# EAGLE design portable-atmega (EAGLE 7.2.0)
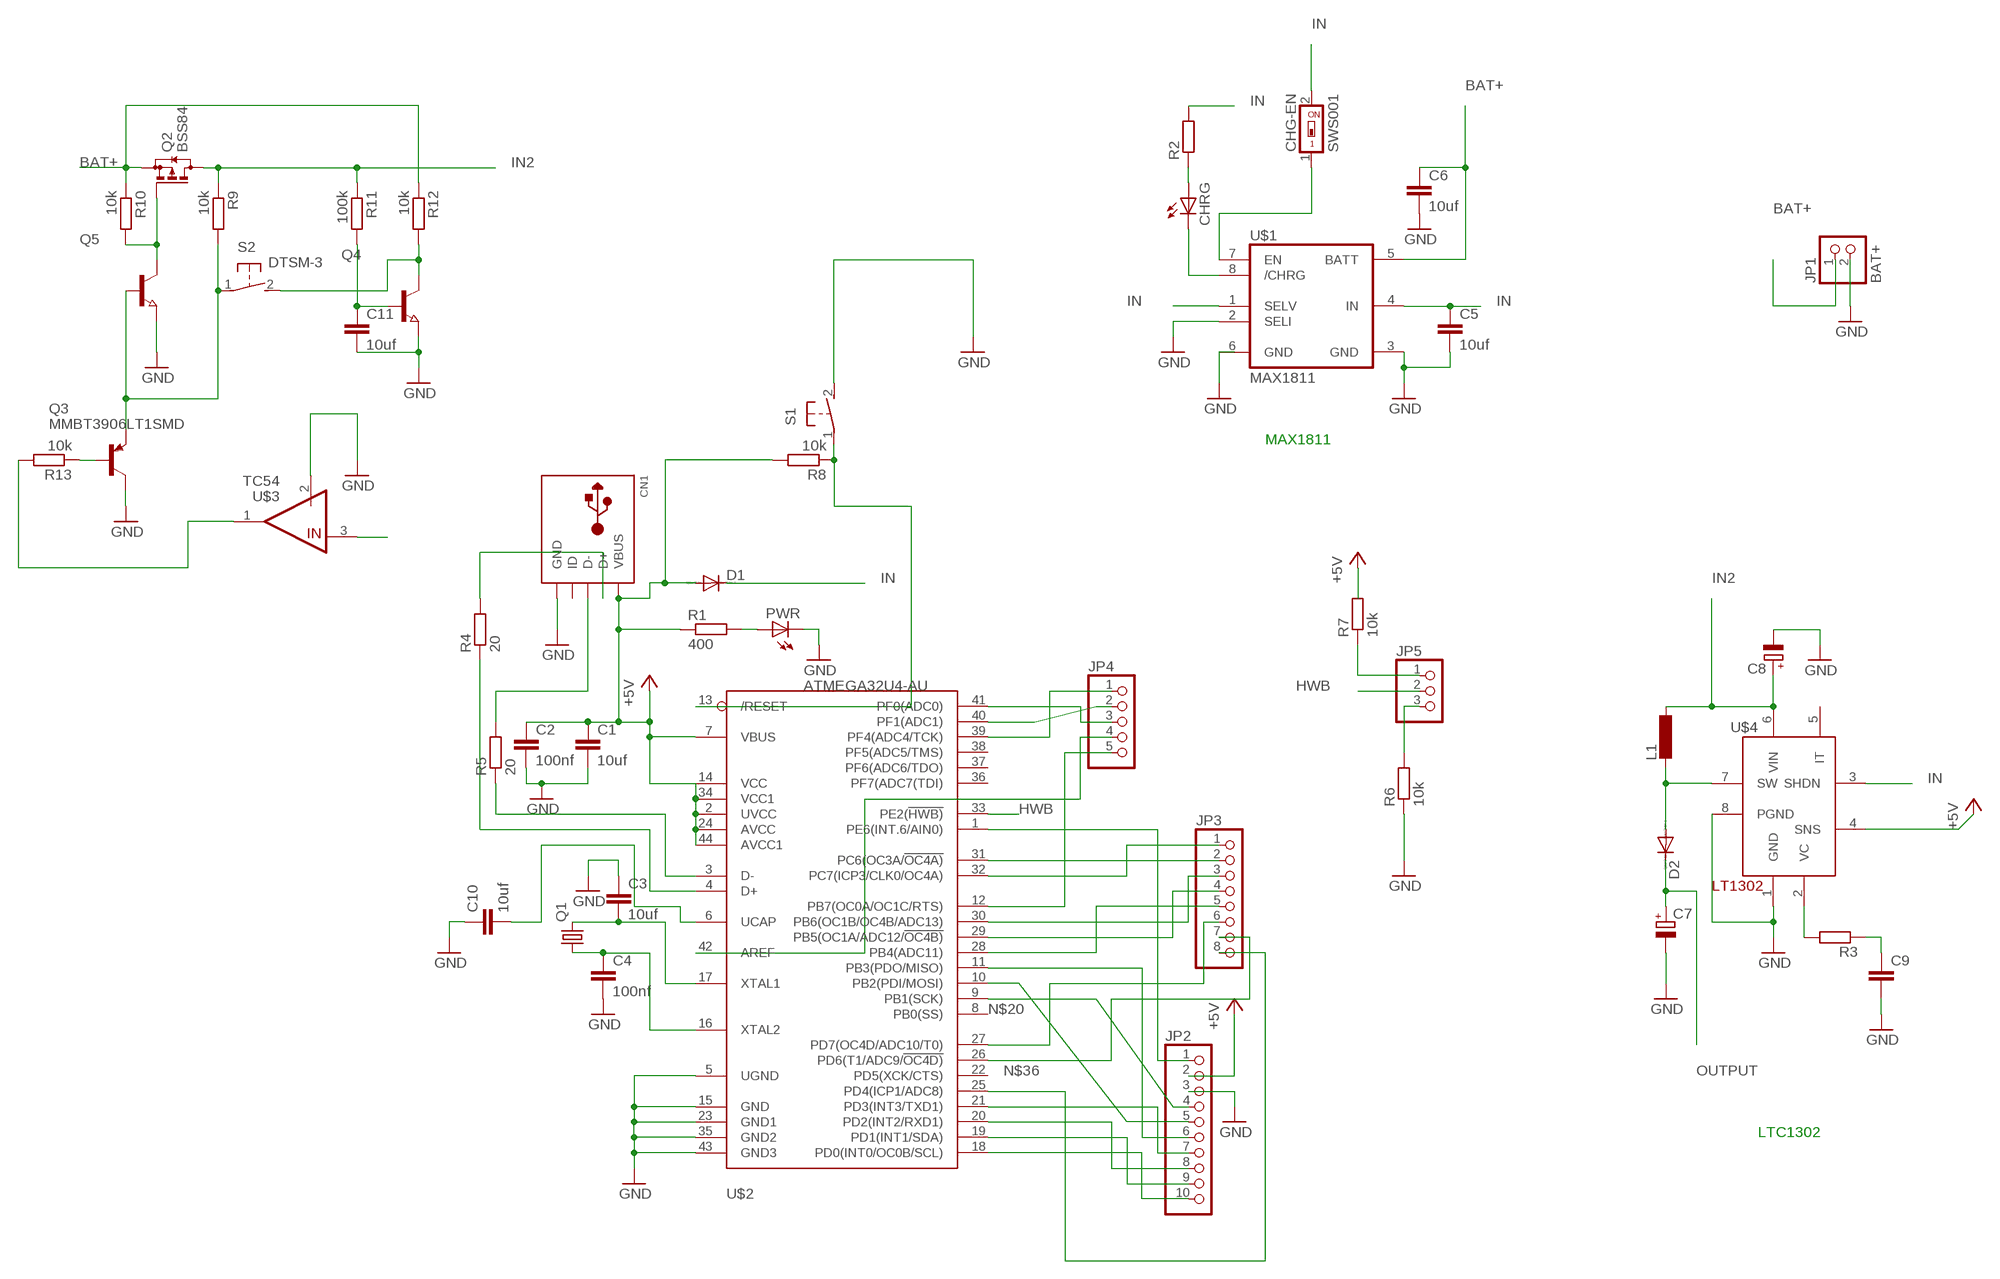
[diagram p0: schematic, sheet 1]

## Parts
C1  10uf  C-EUC1206  [C1206]
C2  100nf  C-EUC1206  [C1206]
C3  10uf  C-EUC1206  [C1206]
C4  100nf  C-EUC1206  [C1206]
C5  10uf  C-EUC1206  [C1206]
C6  10uf  C-EUC1206  [C1206]
C7  CPOL-EUD  [PANASONIC_D]
C8  CPOL-EUD  [PANASONIC_D]
C9  C-EUC1206  [C1206]
C10  10uf  C-EUC1206  [C1206]
C11  10uf  C-EUC1206  [C1206]
CHG-EN  SWS001  [SMS-001]
CHRG  LEDCHIPLED_1206  [CHIPLED_1206]
CN1  USBMINIB  [USB-MINIB]
D1  DIODE-DO214AA  [DO214AA]
D2  DIODE-DO214AA  [DO214AA]
JP1  BAT+  PINHD-1X2  [1X02]
JP2  PINHD-1X10  [1X10]
JP3  PINHD-1X8  [1X08]
JP4  PINHD-1X5  [1X05]
JP5  PINHD-1X3  [1X03]
L1  DO3316P  [DO3316P]
PWR  LEDCHIPLED_1206  [CHIPLED_1206]
Q1  CRYSTALHC49S  [HC49/S]
Q2  BSS84  [SOT23]
Q3  MMBT3906LT1SMD  [SOT23-BEC]
Q4  NPN-TRANSISTOR_SOT23  [SOT23]
Q5  NPN-TRANSISTOR_SOT23  [SOT23]
R1  400  R-EU_R1206  [R1206]
R2  R-EU_R1206  [R1206]
R3  R-EU_R1206  [R1206]
R4  20  R-EU_R1206  [R1206]
R5  20  R-EU_R1206  [R1206]
R6  10k  R-EU_R0805  [R0805]
R7  10k  R-EU_R0805  [R0805]
R8  10k  R-EU_R0805  [R0805]
R9  10k  R-EU_R0805  [R0805]
R10  10k  R-EU_R1206  [R1206]
R11  100k  R-EU_R0805  [R0805]
R12  10k  R-EU_R1206  [R1206]
R13  10k  R-EU_R0805  [R0805]
S1  31-XXSKINNY  [B3F-31XX-SKINNIER]
S2  DTSM-3  [DTSM-3]
U$1  MAX1811  [SO08]
U$2  ATMEGA32U4-AU  [TQFP44]
U$3  TC54  [SOT23-3]
U$4  LT1302SO8  [SO08]

## Nets
+5V: C1.1 C2.1 CN1.VBUS D1.A JP2.2 R1.1 R7.2 R8.2 U$2.2(UVCC) U$2.7(VBUS) U$2.14(VCC) U$2.24(AVCC) U$2.34(VCC1) U$2.44(AVCC1) U$4.4(SNS)
BAT+: C6.1 JP1.1 Q2.2(S) R10.1 R12.1 U$1.5(BATT) U$3.3(VIN)
GND: C1.2 C2.2 C3.1 C4.2 C5.2 C6.2 C7.- C8.- C9.2 C10.1 C11.2 CN1.GND JP1.2 JP2.3 PWR.C Q3.C Q4.2(E) Q5.2(E) R6.1 S1.2(S) U$1.2(SELI) U$1.3(GND) U$1.6(GND) U$2.5(UGND) U$2.15(GND) U$2.23(GND1) U$2.35(GND2) U$2.43(GND3) U$3.2(VSS) U$4.1(GND) U$4.8(PGND)
HWB: JP5.2 U$2.33(PE2(!HWB))
IN: C5.1 CHG-EN.2 D1.C R2.2 U$1.1(SELV) U$1.4(IN) U$4.3(SHDN)
IN2: C8.+ L1.2 Q2.3(D) R9.1 R11.1 U$4.6(VIN)
N$1: PWR.A R1.2
N$2: CN1.D- R5.2
N$3: C4.1 Q1.1 U$2.16(XTAL2)
N$4: CHRG.C U$1.8(/CHRG)
N$5: CHRG.A R2.1
N$6: C3.2 Q1.2 U$2.17(XTAL1)
N$7: CHG-EN.1 U$1.7(EN)
N$8: D2.A L1.1 U$4.7(SW)
N$9: R4.1 U$2.4(D+)
N$10: CN1.D+ R4.2
N$11: R5.1 U$2.3(D-)
N$12: C9.1 R3.1
N$13: R3.2 U$4.2(VC)
N$14: C10.2 U$2.6(UCAP)
N$15: JP2.10 U$2.18(PD0(INT0/OC0B/SCL))
N$16: JP2.9 U$2.19(PD1(INT1/SDA))
N$17: JP2.8 U$2.20(PD2(INT2/RXD1))
N$18: JP2.7 U$2.21(PD3(INT3/TXD1))
N$19: JP2.1 U$2.1(PE6(INT.6/AIN0))
N$20: JP2.4 U$2.9(PB1(SCK))
N$21: JP2.5 U$2.10(PB2(PDI/MOSI))
N$22: JP2.6 U$2.11(PB3(PDO/MISO))
N$23: JP4.4 U$2.42(AREF)
N$24: JP4.3 U$2.41(PF0(ADC0))
N$25: JP4.2 U$2.40(PF1(ADC1))
N$26: JP4.1 U$2.39(PF4(ADC4/TCK))
N$27: JP5.3 R6.2
N$28: JP3.1 U$2.32(PC7(ICP3/CLK0/OC4A))
N$29: JP3.2 U$2.31(PC6(OC3A/!OC4A))
N$30: JP3.3 U$2.30(PB6(OC1B/OC4B/ADC13))
N$31: JP5.1 R7.1
N$32: R8.1 S1.1(P) U$2.13(/RESET)
N$33: JP3.4 U$2.29(PB5(OC1A/ADC12/!OC4B))
N$34: JP3.5 U$2.28(PB4(ADC11))
N$35: JP3.6 U$2.27(PD7(OC4D/ADC10/T0))
N$36: JP3.7 U$2.26(PD6(T1/ADC9/!OC4D))
N$37: JP3.8 U$2.25(PD4(ICP1/ADC8))
N$38: JP4.5 U$2.12(PB7(OC0A/OC1C/RTS))
N$39: Q2.1(G) Q5.3(C) R10.2
N$40: Q3.E Q5.1(B) R9.2 S2.1
N$42: C11.1 Q4.1(B) R11.2
N$43: Q4.3(C) R12.2 S2.2
N$46: R13.2 U$3.1(VOUT)
N$47: Q3.B R13.1
OUTPUT: C7.+ D2.C
Unconnected: CN1.ID U$2.8(PB0(SS)) U$2.22(PD5(XCK/CTS)) U$2.36(PF7(ADC7(TDI)) U$2.37(PF6(ADC6/TDO)) U$2.38(PF5(ADC5/TMS)) U$4.5(IT)

## Notes on the sheet
- MAX1811
- LTC1302

## Library data of the parts
C1-C6 C9-C11 = resistor:C-EU: CAPACITOR, European symbol
C7 C8 = resistor:CPOL-EU: POLARIZED CAPACITOR, European symbol
CHG-EN = smd-special:SWS001: SMD Dip Switch 1 pol.
CHRG PWR = adafruit:LED: LED OSRAM: - CHIPLED LG R971, LG N971, LY N971, LG Q971, LY Q971, LO R971, LY R971 LH N974, LH R974 LS Q976, LO Q976, LY Q976 LO Q996 - Hyper CHIPLED LW Q18S LB Q993, LB Q99A, LB R99A - SideLED LS A670, LO A670, LY A670, LG A670, LP A670 LB A673, LV A673, LT A673, LW A673 LH A674 LY A675 LS A676, LA A676, LO A676, LY A676, LW A676 LS A679, LY A679, LG A679 - Hyper Micro SIDELED® LS Y876, LA Y876, LO Y876, LY Y876 LT Y87S - SmartLED LW L88C, LW L88S LB L89C, LB L89S, LG L890 LS L89K, LO L89K, LY L89K LS L896, LA L896, LO L896, LY L896 - TOPLED LS T670, LO T670, LY T670, LG T670, LP T670 LSG T670, LSP T670, LSY T670, LOP T670, LYG T670 LG T671, LOG T671, LSG T671 LB T673, LV T673, LT T673, LW T673 LH T674 LS T676, LA T676, LO T676, LY T676, LB T676, LH T676, LSB T676, LW T676 LB T67C, LV T67C, LT T67C, LS T67K, LO T67K, LY T67K, LW E67C LS E67B, LA E67B, LO E67B, LY E67B, LB E67C, LV E67C, LT E67C LW T67C LS T679, LY T679, LG T679 LS T770, LO T770, LY T770, LG T770, LP T770 LB T773, LV T773, LT T773, LW T773 LH T774 LS E675, LA E675, LY E675, LS T675 LS T776, LA T776, LO T776, LY T776, LB T776 LHGB T686 LT T68C, LB T68C - Hyper Mini TOPLED® LB M676 - Mini TOPLED Santana® LG M470 LS M47K, LO M47K, LY M47K Source: http://www.osram.convergy.de/
CN1 = adafruit:USB: USB Connectors USBMINIB - Surface Mount Female Mini-B USB Connector 4UConnector: 06564 By microbuilder.eu Thru-hole RA Female Mini-B USB Connector 4UConnector: 18732 By ladyada.net
D1 D2 = diode:DIODE-: DIODE
JP1 = pinhead:PINHD-1X2: PIN HEADER
JP2 = pinhead:PINHD-1X10: PIN HEADER
JP3 = pinhead:PINHD-1X8: PIN HEADER
JP4 = pinhead:PINHD-1X5: PIN HEADER
JP5 = adafruit:PINHD-1X3: PIN HEADER
L1 = inductor-coilcraft:DO3316P: COILCRAFT; OC_FARNELL: unknown; OC_NEWARK: unknown
Q1 = adafruit:CRYSTAL: CRYSTAL; OC_FARNELL: 1667008; OC_NEWARK: unknown
Q2 = transistor-small-signal:BSS84: P-CHANNEL MOS FET
Q3 = transistor-pnp:MMBT3906*: PNP Transistror
Q4 Q5 = semicon-smd-ipc:NPN-TRANSISTOR_: NPN TRANSISTOR
R1-R5 R10 R12 = resistor:R-EU_: RESISTOR, European symbol
R6-R9 R11 R13 = solar3-1:R-EU_: RESISTOR, European symbol
S1 = adafruit:31-XX: OMRON SWITCH Now with beefier pads!
S2 = switch-tact:DTSM-3
U$1 = max1811-modified:MAX1811
U$2 = adafruit:ATMEGA32U4: http://www.ladyada.net/library/eagle
U$3 = microchip:TC54
U$4 = adafruit:LT1302

## Board
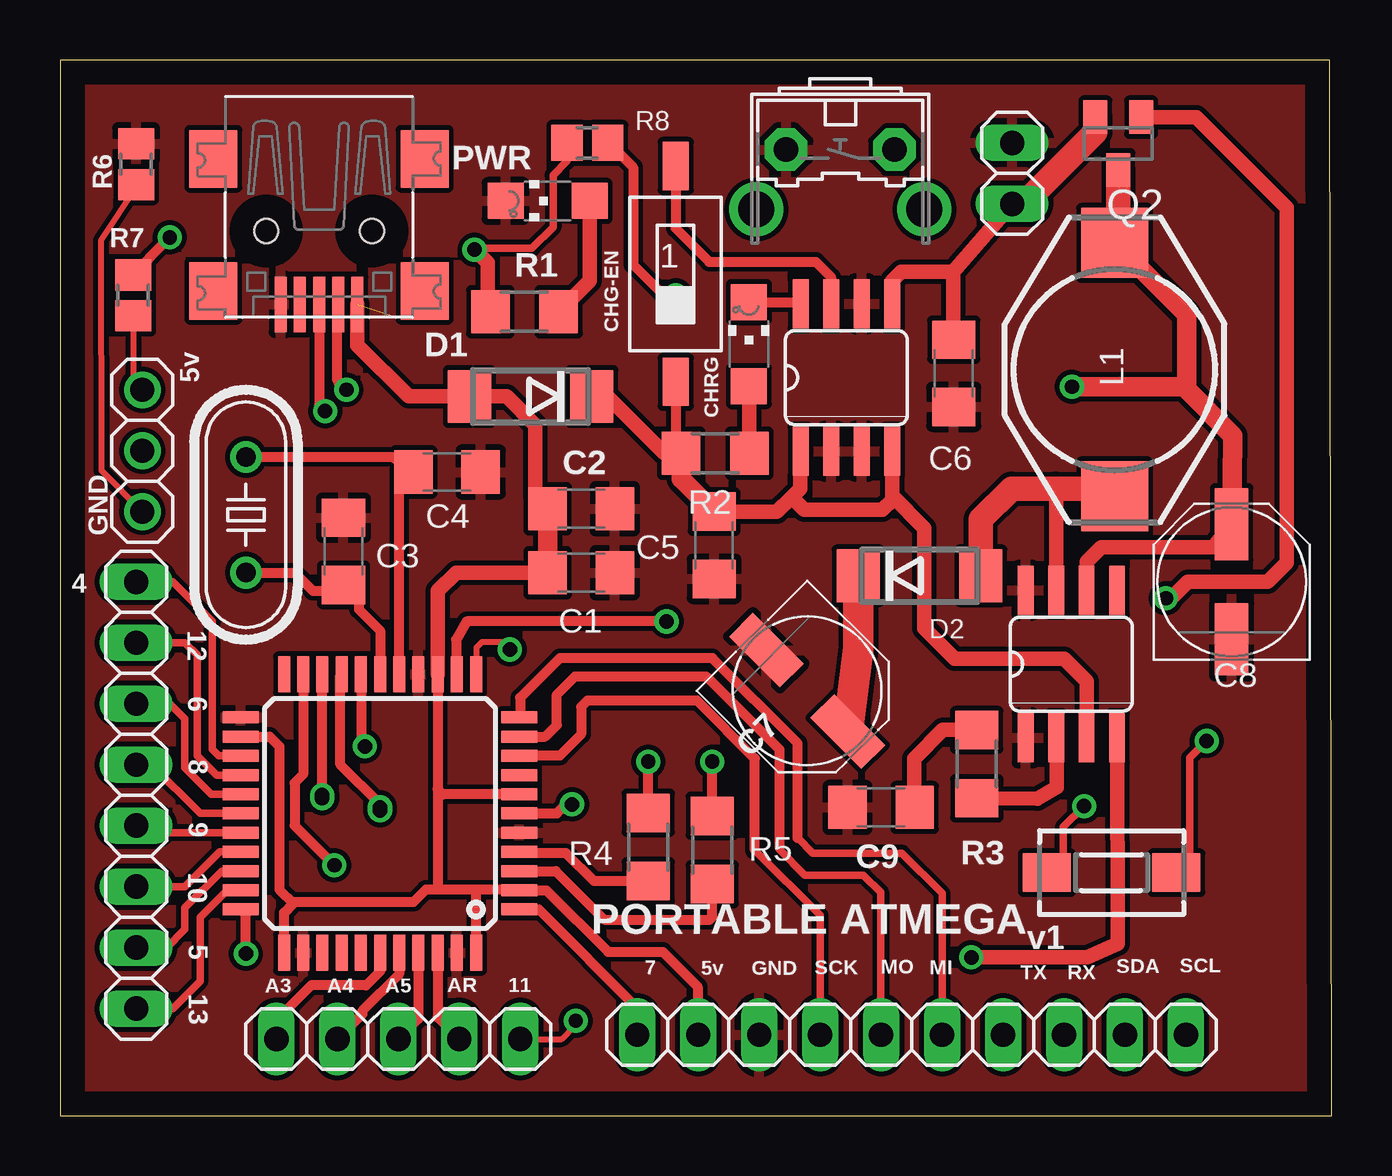
[diagram p1: board, top side]
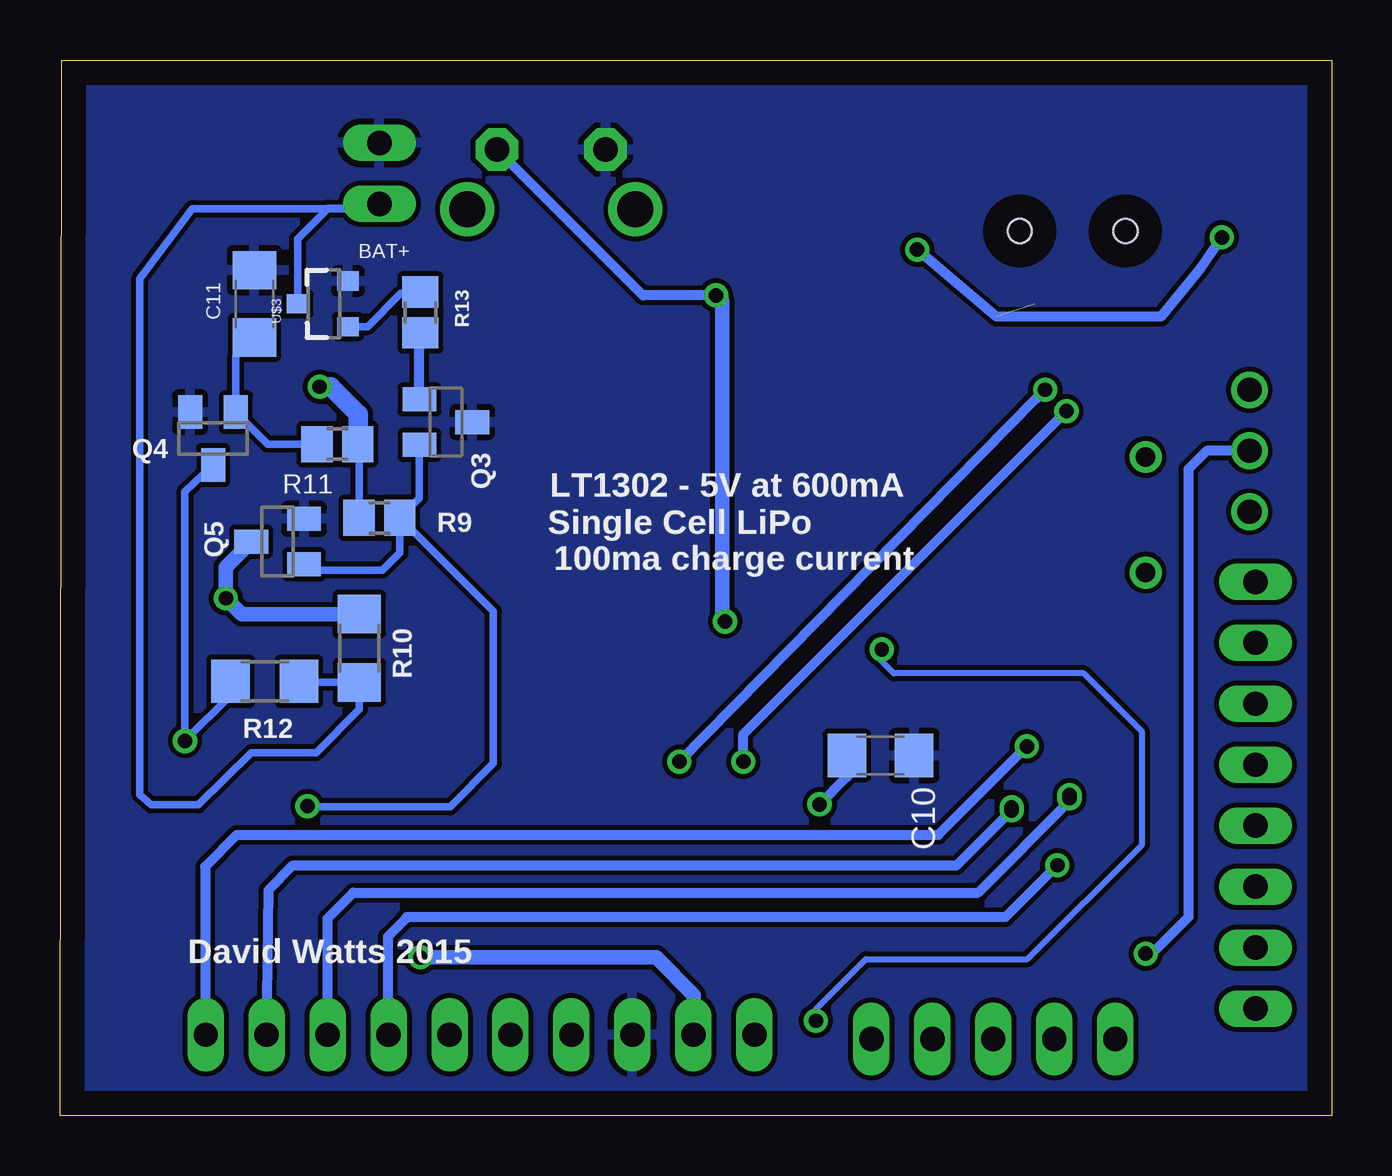
[diagram p2: board, bottom side, seen from below]

Size 52.98 x 43.99 mm. Coordinates in mm from the lower left corner, seen from the top.
Outline: 0,0 52.98,0 52.91,43.99 0,43.99 0,0
Copper layers (1*16): Top 0.035mm / dielectric 1.5mm / Bottom 0.035mm
Design rules "default": minimum track width 10mil, minimum drill 24mil, track to track 8mil, track to pad 8mil, pad to pad 8mil, via to via 8mil, smd to smd 8mil, copper to edge 40mil, drill to drill 8mil, minimum pad ring 10mil, minimum via ring 8mil, stop-mask expansion 4mil, vias tented up to drill 0mil, thermal gap 10mil

### Footprints (pad centres in the part's own frame; a part is rotated, then mirrored left to right if it is on the bottom)
C1206 = smd 1.6 x 1.8: 1 -1.4,0; 2 1.4,0
PANASONIC_D = smd 3 x 1.4: + 2.4,0; - -2.4,0
SMS-001 = smd 1.092 x 2.007: 1 0,-4.496; 2 0,4.496
CHIPLED_1206 = smd 1.5 x 1.5: A 0,-1.75; C 0,1.75
USB-MINIB = smd 0.5 x 2.308: D+ 0,4.064; D- -0.8,4.064; GND 1.6,4.064; ID 0.8,4.064; VBUS -1.6,4.064 | smd 2 x 2.4: GND1 -4.4,-2; GND2 -4.4,3.5; GND3 4.4,3.5; GND4 4.4,-2 | hole 1: -2.2,1; 2.2,1
DO214AA = smd 1.8 x 2.2: A 2.55,0; C -2.55,0
1X02 = drill 1.016 long: 1 -1.27,0; 2 1.27,0
1X10 = drill 1.016 long: 1 -11.43,0; 2 -8.89,0; 3 -6.35,0; 4 -3.81,0; 5 -1.27,0; 6 1.27,0; 7 3.81,0; 8 6.35,0; 9 8.89,0; 10 11.43,0
1X08 = drill 1.016 long: 1 -8.89,0; 2 -6.35,0; 3 -3.81,0; 4 -1.27,0; 5 1.27,0; 6 3.81,0; 7 6.35,0; 8 8.89,0
1X05 = drill 1.016 long: 1 -5.08,0; 2 -2.54,0; 3 0,0; 4 2.54,0; 5 5.08,0
1X03 = drill 1.016: 1 -2.54,0; 2 0,0; 3 2.54,0
DO3316P = smd 2.92 x 2.79: 1 -5.28,0; 2 5.28,0
HC49/S = drill 0.813: 1 -2.413,0; 2 2.413,0
SOT23 = smd 1 x 1.4: 1 -0.95,-1.1; 2 0.95,-1.1; 3 0,1.1
SOT23-BEC = smd 1 x 1.4: B -0.95,-1.1; C 0,1.1; E 0.95,-1.1
R1206 = smd 1.6 x 1.803: 1 -1.422,0; 2 1.422,0
R0805 = smd 1.3 x 1.5: 1 -0.85,0; 2 0.85,0
B3F-31XX-SKINNIER = drill 1.016 pad 1.778 octagon: 1 -2.261,-1.245; 2 2.261,-1.245 | drill 1.499 pad 2.032: 3 -3.505,1.245; 4 3.505,1.245
DTSM-3 = smd 2 x 1.6: 1 -2.7,0; 2 2.7,0
SO08 = smd 0.66 x 2.032: 1 -1.905,-3.073; 2 -0.635,-3.073; 3 0.635,-3.073; 4 1.905,-3.073; 5 1.905,3.073; 6 0.635,3.073; 7 -0.635,3.073; 8 -1.905,3.073
TQFP44 = smd 1.5 x 0.5: 1 -5.8,4; 2 -5.8,3.2; 3 -5.8,2.4; 4 -5.8,1.6; 5 -5.8,0.8; 6 -5.8,0; 7 -5.8,-0.8; 8 -5.8,-1.6; 9 -5.8,-2.4; 10 -5.8,-3.2; 11 -5.8,-4; 23 5.8,-4; 24 5.8,-3.2; 25 5.8,-2.4; 26 5.8,-1.6; 27 5.8,-0.8; 28 5.8,0; 29 5.8,0.8; 30 5.8,1.6; 31 5.8,2.4; 32 5.8,3.2; 33 5.8,4 | smd 0.5 x 1.5: 12 -4,-5.8; 13 -3.2,-5.8; 14 -2.4,-5.8; 15 -1.6,-5.8; 16 -0.8,-5.8; 17 0,-5.8; 18 0.8,-5.8; 19 1.6,-5.8; 20 2.4,-5.8; 21 3.2,-5.8; 22 4,-5.8; 34 4,5.8; 35 3.2,5.8; 36 2.4,5.8; 37 1.6,5.8; 38 0.8,5.8; 39 0,5.8; 40 -0.8,5.8; 41 -1.6,5.8; 42 -2.4,5.8; 43 -3.2,5.8; 44 -4,5.8
SOT23-3 = smd 0.8 x 0.9: 1 -0.95,-1; 2 0.95,-1; 3 0,1.1

### Placement (x,y rotation side)
C1  21.72,22.63 0 top
C2  21.72,25.3 0 top
C3  11.81,23.52 270 top
C4  16.13,26.82 0 top
C5  27.25,23.77 270 top
C6  37.24,30.94 270 top
C7  31.13,17.71 315 top
C8  48.82,22.25 90 top
C9  34.21,12.85 180 top
C10  18.8,15.01 180 bottom
C11  44.88,33.83 90 bottom
CHG-EN  25.65,35.08 180 top
CHRG  28.7,32.16 0 top
CN1  10.79,37.87 180 top
D1  19.61,29.97 180 top
D2  35.81,22.5 0 top
JP1  39.67,39.27 90 top
JP2  35.48,3.38 0 top
JP3  3.17,13.36 90 top
JP4  14.1,3.2 0 top
JP5  3.43,27.71 270 top
L1  43.94,31.09 90 top
PWR  20.32,38.13 90 top
Q1  7.75,25.04 270 top
Q2  44.09,40.51 180 top
Q3  36.91,28.91 270 bottom
Q4  46.61,28.22 180 bottom
Q5  43.92,23.93 90 bottom
R1  19.35,33.5 0 top
R2  27.3,27.61 180 top
R3  38.2,14.66 270 top
R4  24.51,11.2 90 top
R5  27.18,11.07 90 top
R6  3.17,39.65 270 top
R7  3.05,34.19 90 top
R8  21.97,40.54 180 top
R9  39.67,24.92 0 bottom
R10  40.51,19.48 90 bottom
R11  41.43,27.99 180 bottom
R12  44.45,18.11 180 bottom
R13  37.97,33.48 90 bottom
S1  32.51,39.01 180 top
S2  43.82,10.13 0 top
U$1  32.77,30.76 0 top
U$2  13.34,12.6 180 top
U$3  41.99,33.83 90 bottom
U$4  42.14,18.82 0 top

### Tracks (layer width: path | path; a pad name or v marks a point on that pad's centre or on a via)
+5V  (via drill 0.6)  (1 unrouted)
  Top 0.305: R8.2 21.12,39.76 20.55,39.19 20.55,37.03 19.66,36.14 17.32,36.14 v17.27,36.09
  Top 0.406: U$2.14 15.74,13.61 | 15.74,13.61 15.74,9.44 15.75,9.42 | U$2.34 9.34,8.47 9.72,8.85 | 9.72,8.85 9.78,8.92 14.73,8.92 15.24,9.42 15.75,9.42 | 17.27,9.42 19.11,9.42 U$2.2 20.27,9.4 22.83,6.83 25.12,6.83 26.57,5.38 26.57,3.4 JP2.2 | 17.27,9.42 15.75,9.42 | U$2.44 17.34,9.36 17.27,9.42 | U$2.24 8.74,15.8 9.14,15.39 9.14,9.42 9.72,8.85 | U$2.7 15.95,13.4 15.74,13.61 | R7.2 2.96,34.91 3.81,35.84 v4.57,36.6
  Top 0.61: C1.1 16.51,22.63 15.75,21.87 15.75,18.41 U$2.14 | v17.27,36.09 17.83,35.53 17.83,33.6 R1.1 | CN1.VBUS 12.4,32.11 14.53,29.97 D1.A 18.62,29.97 19.81,28.78 19.81,25.8 C2.1 | CN1.VBUS | v37.97,6.6 42.8,6.6 44.07,7.16 U$4.4
  Top 0.813: C2.1 C1.1
  Bottom 0.406: v4.57,36.6 5.46,35.33 7.11,33.3 13.97,33.3 v17.27,36.09
  Bottom 0.61: v37.97,6.6 28.14,6.6 26.57,5.03 26.57,3.4 JP2.2
BAT+
  Top 0.61: U$1.5 34.67,34.8 35.05,35.18 37.21,35.18 | 37.21,35.18 JP1.1 | 37.21,35.18 37.21,32.36 C6.1
  Top 1.016: Q2.2 43.14,40.99 39.93,37.77 39.42,37.77 JP1.1
  Bottom 0.305: U$3.3 43.09,36.54 41.81,37.82 39.37,37.82 JP1.1 39.4,37.8 47.47,37.8 49.66,34.87 49.66,13.39 49.17,12.95 47.22,12.95 45.01,15.14 42.32,15.14 40.51,16.94 R10.1 43.08,18.06 R12.1
GND
  pour Bottom: -1.96,44.22 53.7,44.81 53.26,-0.89 -2.46,-1.55
  pour Top: 53.82,-1.24 -1.96,-1.04 -1.98,44.32 54.74,44.37
HWB  (via drill 0.6)
  Top 0.406: v7.75,6.76 7.75,8.39 U$2.33
  Bottom 0.406: JP5.2 5.21,27.71 5.97,26.95 5.97,8.28 7.62,6.63 v7.75,6.76
IN
  Top 0.406: CHG-EN.2 25.65,28.19 R2.2
  Top 0.61: 34.67,25.93 U$1.4 34.67,25.83 | D1.C 22.81,29.97 25.15,27.64 25.86,27.64 R2.2 | C5.1 29.87,25.17 30.48,25.78 | 30.48,25.78 30.84,26.14 30.84,27.66 U$1.1 | 34.67,25.83 34.67,25.65 34.26,25.25 31.01,25.25 30.48,25.78 | U$4.3 42.77,18.11 41.83,19.05 37.29,19.05 36.02,20.32 36.02,24.49 34.67,25.83
  Top 0.813: R2.2 25.88,26.55 C5.1
IN2  (via drill 0.6)
  Top 0.305: 43.56,35.48 L1.2
  Top 0.61: U$4.6 42.77,23.09 43.38,23.7 48.04,23.7 C8.+
  Top 0.813: L1.2 46.94,33.37 46.94,30.38 46.84,30.38 | v42.16,30.38 46.84,30.38 | C8.+ 48.87,28.35 46.84,30.38
  Top 1.016: Q2.3 44.09,35.97 43.94,35.81 L1.2
  Bottom 0.305: R9.1 40.53,27.99 R11.1
  Bottom 0.813: v42.16,30.38 41.71,30.38 40.56,29.24 40.56,28 R11.1
N$1
  Top 0.61: PWR.A 22.07,34.8 R1.2
N$2  (via drill 0.6)
  Top 0.406: R5.2 v27.18,14.76 | v11.94,30.25 11.56,30.63 11.56,33.01 CN1.D-
  Bottom 0.406: 27.05,14.76 v27.18,14.76 12.32,29.87 v11.94,30.25
N$3
  Top 0.406: Q1.1 13.84,27.46 C4.1 14.14,26.23 U$2.16
N$4
  Top 0.406: CHRG.C 30.79,33.91 U$1.8
N$5
  Top 0.406: 28.73,30.38 CHRG.A
  Top 0.61: 28.73,30.38 R2.1
N$6
  Top 0.406: Q1.2 9.78,22.63 10.54,21.87 11.56,21.87 C3.2 12.45,22.12 12.45,21.1 13.34,20.22 U$2.17
N$7
  Top 0.406: CHG-EN.1 25.65,36.98 27.05,35.59 31.5,35.59 32.13,34.95 U$1.7
N$8
  Top 0.61: U$4.7 41.5,26.11 41.48,26.14
  Top 1.016: D2.A 38.36,24.85 39.65,26.14 41.48,26.14 43.62,26.14 L1.1
N$9
  Top 0.406: R4.1 22.25,9.78 21.08,10.95 19.19,10.95 U$2.4
N$10  (via drill 0.6)
  Top 0.406: R4.2 v24.51,14.76 | CN1.D+ 10.8,29.62 v11.05,29.36
  Bottom 0.406: v24.51,14.76 24.51,15.9 v11.05,29.36
N$11
  Top 0.406: U$2.3 20.66,10.2 22.68,8.18 27.08,8.18 27.18,8.28 R5.1
N$12
  Top 0.61: R3.1 36.78,16.08 35.59,14.88 35.59,13.2 C9.1
N$13
  Top 0.61: R3.2 40.72,13.21 41.53,13.69 U$4.2
N$14  (via drill 0.6)
  Top 0.406: v21.34,12.98 21.08,12.98 20.7,12.6 U$2.6
  Bottom 0.406: v21.34,12.98 20.19,14.12 C10.2
N$15  (via drill 0.6)
  Top 0.406: v12.7,15.39 12.57,15.65 12.57,18.36 U$2.18
  Bottom 0.406: 12.57,15.52 v12.7,15.39 16.38,11.71 45.62,11.71 46.94,10.39 46.94,3.4 JP2.10
N$16  (via drill 0.6)
  Top 0.406: v13.34,12.73 v13.34,12.85 13.34,12.98 11.68,14.63 11.68,18.35 U$2.19
  Bottom 0.406: v13.34,12.73 15.62,10.44 43.28,10.44 44.3,9.4 44.4,3.4 JP2.9
N$17  (via drill 0.6)
  Top 0.406: v10.92,13.23 v10.92,13.36 10.92,18.39 U$2.20
  Bottom 0.406: v10.92,13.23 10.92,13.11 14.73,9.3 40.77,9.3 41.83,8.23 JP2.8
N$18  (via drill 0.6)
  Top 0.406: U$2.21 10.14,14.22 9.78,13.87 9.78,12.09 v11.43,10.44
  Bottom 0.406: v11.43,10.44 13.59,8.28 38.56,8.28 38.56,8.23 39.32,7.47 39.32,3.4 JP2.7
N$19
  Top 0.406: U$2.1 19.95,8.6 24.08,4.47 24.08,3.4 JP2.1
N$20
  Top 0.305: JP2.4 31.67,8.36 28.96,11.07
  Top 0.406: 28.96,11.07 28.96,14.88 26.54,17.3 21.97,17.3 21.72,17.04 21.72,15.9 20.83,15.01 19.15,15.01 U$2.9
N$21
  Top 0.305: 29.97,11.2 29.97,11.1 31.04,10.03 33.48,10.03 34.19,9.32 34.19,3.4 JP2.5
  Top 0.406: U$2.10 20.22,15.8 20.7,16.28 20.7,17.55 21.46,18.31 26.92,18.31 29.97,15.27 29.97,11.2
N$22
  Top 0.305: JP2.6 36.75,9.27 35.08,10.95 31.37,10.95 30.73,11.58
  Top 0.406: 30.73,11.58 30.73,15.52 27.18,19.08 20.83,19.08 19.18,17.42 19.18,16.64 U$2.11
N$23
  Top 0.406: U$2.42 15.74,4.1 JP4.4
N$24
  Top 0.406: U$2.41 14.94,4.04 JP4.3
N$25
  Top 0.406: U$2.40 14.14,5.91 12.6,4.37 12.6,4.24 JP4.2
N$26
  Top 0.406: U$2.39 13.34,6.02 12.75,5.44 10.47,5.44 8.99,3.96 8.99,3.23 JP4.1
N$27
  Top 0.254: R6.2 3.18,38.71 1.7,36.47 1.73,26.9 JP5.3
N$28
  Top 0.305: JP3.1 4.7,4.47 5.84,5.61 5.84,8.28 6.99,9.42 7.51,9.42 U$2.32
N$29
  Top 0.305: JP3.2 4.45,7.01 5.21,7.77 5.21,8.66 6.73,10.19 7.52,10.19 U$2.31
N$30
  Top 0.305: U$2.30 6.66,11 5.21,9.55 JP3.3
N$31
  Top 0.254: R7.1 3.05,30.63 JP5.1
N$32  (via drill 0.6)
  Top 0.406: R8.1 22.86,40.54 23.88,39.52 23.88,35.46 25.15,34.19 v25.65,34.19 | v25.27,20.6 16.94,20.6 16.51,19.84 16.51,18.42 U$2.13
  Bottom 0.406: v25.65,34.19 28.7,34.19 S1.1 | v25.27,20.6 25.4,20.73
  Bottom 0.61: 25.4,20.73 25.4,33.93 v25.65,34.19
N$33
  Top 0.305: U$2.29 3.47,11.8 JP3.4
N$34
  Top 0.305: U$2.28 5.84,12.6 3.81,14.63 JP3.5
N$35
  Top 0.305: U$2.27 6.31,13.4 5.21,14.5 5.21,16.54 4.57,17.17 JP3.6
N$36
  Top 0.305: U$2.26 6.53,14.2 5.72,15.01 5.72,19.2 5.21,19.71 JP3.7
N$37
  Top 0.305: U$2.25 6.62,15 6.35,15.27 6.35,20.6 4.7,22.25 JP3.8
N$38  (via drill 0.6)
  Top 0.254: JP4.5 20.9,3.2 21.41,3.71 21.49,3.81 v21.49,3.96 | U$2.12 17.32,18.41 17.32,18.95 17.35,18.97 17.35,19.51 17.58,19.74 18.52,19.74 18.75,19.51 v18.75,19.43
  Bottom 0.254: v21.49,3.96 21.49,4.44 19.41,6.53 12.67,6.53 7.9,11.3 7.9,16 10.34,18.44 18.24,18.44 18.85,19.05 v18.75,19.43
N$39  (via drill 0.6)
  Top 0.61: Q2.1 47.34,41.61 51.11,37.85 51.11,23.04 50.32,22.25 46.99,22.25 46.28,21.54 v46.08,21.56
  Bottom 0.305: 45.24,23.68 Q5.3
  Bottom 0.61: Q5.3 46.08,22.87 v46.08,21.56 45.42,20.9 R10.2
N$40  (via drill 0.6)
  Top 0.305: 41.81,10.13 41.81,12.04 v42.67,12.9
  Top 0.406: S2.1 41.81,10.13
  Bottom 0.305: Q3.E 38.01,25.74 R9.2 | v42.67,12.9 42.65,12.88 36.73,12.88 34.93,14.68 34.93,21.02 R9.2 | R9.2 38.83,23.46 39.55,22.73 43,22.73 Q5.1
  Bottom 0.406: 38.7,25.04 R9.2
N$42
  Bottom 0.305: R11.2 44.33,27.99 Q4.1 45.66,31.66 C11.1
N$43  (via drill 0.6)
  Top 0.305: S2.2 47.07,10.13 47.07,14.91 v47.78,15.62 47.85,15.62
  Bottom 0.305: Q4.3 47.78,26.01 v47.78,15.62 45.87,17.53 R12.2
N$46
  Bottom 0.305: U$3.1 40.17,32.88 38.79,34.26 38.04,34.26 R13.2
N$47
  Bottom 0.406: Q3.B 38.01,31.95 R13.1
OUTPUT
  Top 0.61: 33.15,19.33 C7.+
  Top 1.27: D2.C 33.26,19.45 C7.+

### Text on the board
tNames: 5v | GND | 4 | 12 | 6 | 8 | 9 | 10 | PORTABLE ATMEGA | 5 | v1 | 7 | 5v | GND | SCK | MO | MI | TX | RX | SDA | SCL | 13 | A3 | A4 | A5 | AR | 11
bNames: LT1302 - 5V at 600mA | Single Cell LiPo | 100ma charge current | David Watts 2015